# Altium schematic sheet main.SchDoc
size A4
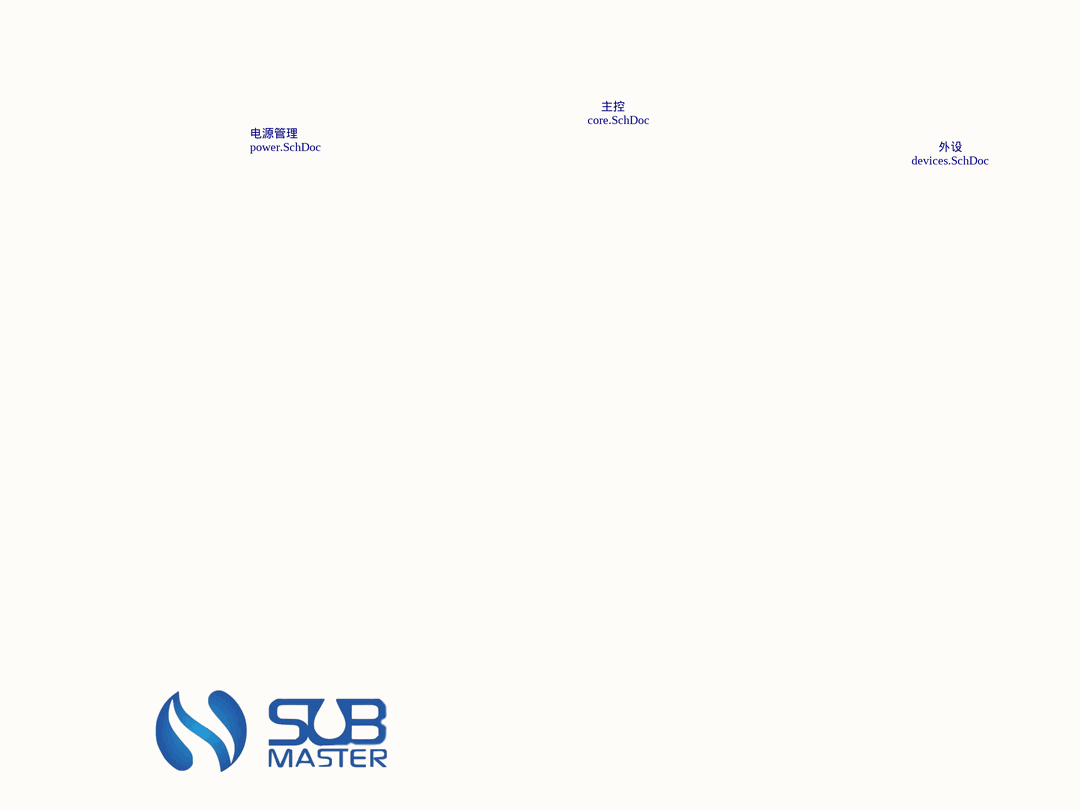
[diagram p0: main.SchDoc]

## Parts
logo1  (no value)  [JMU_LOGO(1.35cm)]
logo2  (no value)  [Sub master logo]

## Sub-sheets
主控 = core.SchDoc: no entries
外设 = devices.SchDoc: no entries
电源管理 = power.SchDoc: no entries

## Library data of the parts
logo1 = JMU_LOGO: LOGO
logo2 = Sub Master logo